# EAGLE design imuwb (EAGLE 7.6.0)
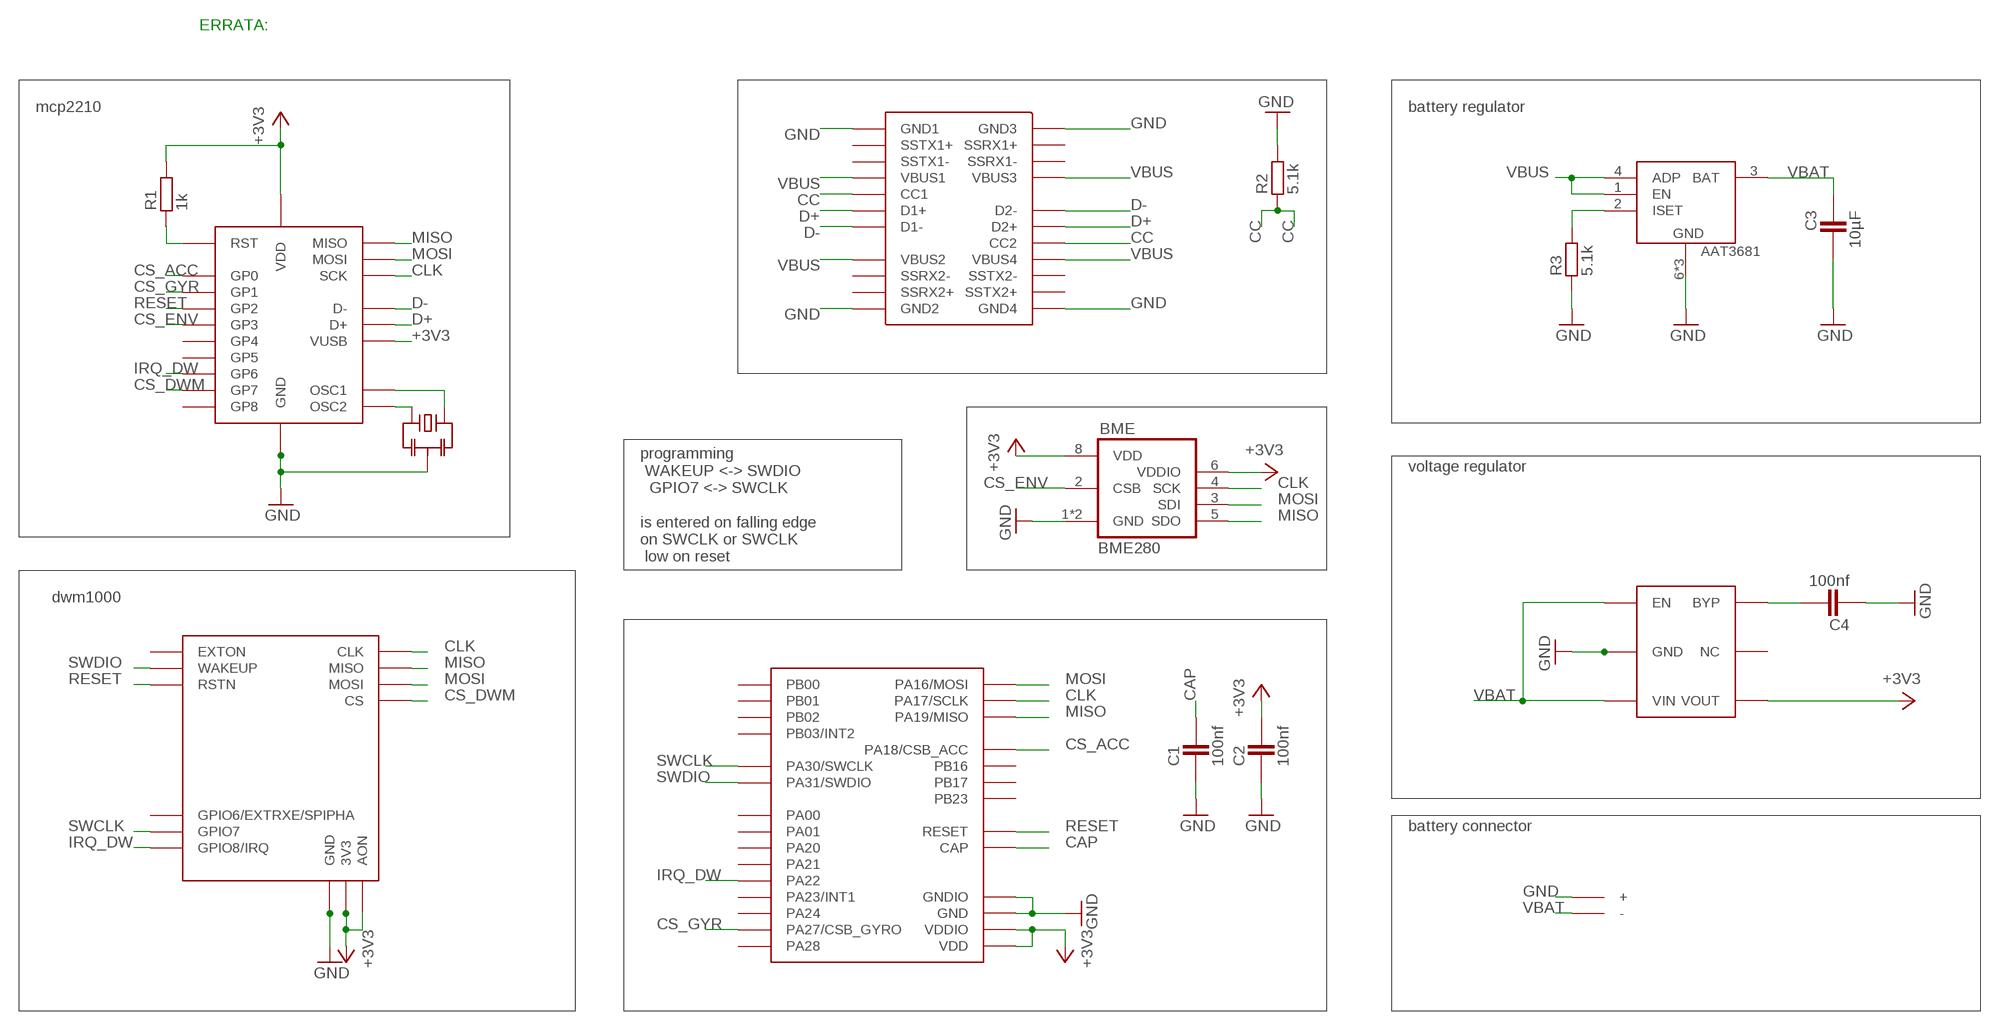
[diagram p0: schematic, sheet 1]

## Parts
AAT3681  AAT3681A  [SC70JW-8]
BME  BME280  [BME280]
BMF  BMF055  [LGA-28]
C1  100nf  CAPACITOR_0402  [CAPC1005X60N]
C2  100nf  CAPACITOR_0402  [CAPC1005X60N]
C3  10µF  CAPACITOR_0603  [CAPC1608X92N]
C4  100nf  CAPACITOR_0402  [CAPC1005X60N]
DWM  DWM1000_SPECIAL  [DWM1000_CASTELLATED_SPECIAL]
MCP2210  MCP2210  [QFN-20]
OSC  CSTCE  [CSCTE_G15C]
R1  1k  RESISTOR_0402  [RESC1005X40AN]
R2  5.1k  RESISTOR_0402  [RESC1005X40AN]
R3  5.1k  RESISTOR_0402  [RESC1005X40AN]
U$1  MIC53533.3V  [MIC5353]
U$2  BATPADS  [BATPADS]
USBC  USBC_NOSBU  [KEYSTONE_953_NOPADS_NOSBU]

## Nets
+3V3: BME.6(VDDIO) BME.8(VDD) BMF.P$3(VDD) BMF.P$28(VDDIO) C2.2 DWM.P$29(AON) DWM.P$30(3V3) DWM.P$31(3V3_1) MCP2210.P$14(VUSB) MCP2210.P$18(VDD) R1.2 U$1.P$6(VOUT)
CAP: BMF.P$9(CAP) C1.2
CC: R2.1 USBC.P$5(CC2) USBC.P$17(CC1)
CLK: BME.4(SCK) BMF.P$23(PA17/SCLK) DWM.P$44(CLK) MCP2210.P$8(SCK)
CS_ACC: BMF.P$22(PA18/CSB_ACC) MCP2210.P$2(GP0)
CS_DWM: DWM.P$41(CS) MCP2210.P$12(GP7)
CS_ENV: BME.2(CSB) MCP2210.P$5(GP3)
CS_GYR: BMF.P$12(PA27/CSB_GYRO) MCP2210.P$3(GP1)
D+: MCP2210.P$16(D+) USBC.P$6(D2+) USBC.P$18(D1+)
D-: MCP2210.P$15(D-) USBC.P$7(D2-) USBC.P$19(D1-)
GND: AAT3681.6(GND) AAT3681.7(GND) AAT3681.8(GND) BME.1(GND) BME.7(GND) BMF.P$2(GND) BMF.P$25(GNDIO) C1.1 C2.1 C3.2 C4.1 DWM.P$32(GND) DWM.P$40(GND1) DWM.P$45(GND2) DWM.P$47(GND3) DWM.P$48(GND4) MCP2210.P$17(GND) MCP2210.P$21(GND1) OSC.P$2 R2.2 R3.1 U$1.P$2(GND) U$1.P$7(GND1) U$2.P$1(+) USBC.P$1(GND4) USBC.P$12(GND3) USBC.P$13(GND1) USBC.P$24(GND2)
IRQ_DW: BMF.P$16(PA22) DWM.P$46(GPIO8/IRQ) MCP2210.P$11(GP6)
MISO: BME.5(SDO) BMF.P$21(PA19/MISO) DWM.P$43(MISO) MCP2210.P$10(MISO)
MOSI: BME.3(SDI) BMF.P$24(PA16/MOSI) DWM.P$42(MOSI) MCP2210.P$6(MOSI)
N$1: MCP2210.P$20(OSC2) OSC.P$1
N$2: MCP2210.P$19(OSC1) OSC.P$3
N$3: AAT3681.2(ISET) R3.2
N$4: C4.2 U$1.P$4(BYP)
N$5: MCP2210.P$1(RST) R1.1
RESET: BMF.P$11(RESET) DWM.P$27(RSTN) MCP2210.P$4(GP2)
SWCLK: BMF.P$8(PA30/SWCLK) DWM.P$28(GPIO7)
SWDIO: BMF.P$7(PA31/SWDIO) DWM.P$26(WAKEUP)
VBAT: AAT3681.3(BAT) C3.1 U$1.P$1(EN) U$1.P$3(VIN) U$2.P$2(-)
VBUS: AAT3681.1(EN) AAT3681.4(ADP) USBC.P$4(VBUS4) USBC.P$9(VBUS3) USBC.P$16(VBUS1) USBC.P$21(VBUS2)
Unconnected: BMF.P$1(PB03/INT2) BMF.P$4(PB02) BMF.P$5(PB01) BMF.P$6(PB00) BMF.P$10(PA28) BMF.P$13(PB23) BMF.P$14(PA24) BMF.P$15(PA23/INT1) BMF.P$17(PA21) BMF.P$18(PA20) BMF.P$19(PB17) BMF.P$20(PB16) BMF.P$26(PA01) BMF.P$27(PA00) DWM.P$25(EXTON) DWM.P$33(GPIO6/EXTRXE/SPIPHA) MCP2210.P$7(GP4) MCP2210.P$9(GP5) MCP2210.P$13(GP8) U$1.P$5(NC) USBC.P$2(SSTX2+) USBC.P$3(SSTX2-) USBC.P$10(SSRX1-) USBC.P$11(SSRX1+) USBC.P$14(SSTX1+) USBC.P$15(SSTX1-) USBC.P$22(SSRX2-) USBC.P$23(SSRX2+)

## Notes on the sheet
- ERRATA:
- mcp2210 | battery regulator
- voltage regulator
- programming
   WAKEUP <-> SWDIO
    GPIO7 <-> SWCLK
  
  is entered on falling edge 
  on SWCLK or SWCLK
   low on reset
- dwm1000
- battery connector

## Library data of the parts
AAT3681 = custom:AAT3681A: 1-cell LiIon charger; PARTNO: AAT3681AIJS-4.2-T1
BME = bosch-bme280:BME280: DIGITAL HUMIDITY, PRESSURE AND TEMPERATURE SENSOR * Digital interface I²C (up to 3.4 MHz) and SPI (3 and 4 wire, up to 10 MHz)* Supply voltage VDD main supply voltage range: 1.71 V to 3.6 V*VDDIO interface voltage range: 1.2 V to 3.6 V Operating range -40…+85 °C, 0…100 % rel. humidity, 300…1100 hPa The library has been designed by Richard Magdycz <https://www.facebook.com/groups/eaglecadsoftUK>; PARTNO: 262-BME280
BMF = custom:BMF055; PARTNO: 262-BMF055
C1-C4 = ipc-7351-capacitor:CAPACITOR_
DWM = dwm1000:DWM1000_SPECIAL; PARTNO: dwm1000
MCP2210 = custom:MCP2210; PARTNO: 579-MCP2210TIMQ
OSC = custom:CSTCE; PARTNO: PRQC12.00CR1010V00L
R1-R3 = ipc-7351-resistor:RESISTOR_
U$1 = bell-card:MIC5353; HEIGHT: .6; PARTNO: MIC5353-3.3YMT
U$2 = custom:BATPADS
USBC = custom:USBC_NOSBU

## Module TEST
Ports: 1(io) 2(io)

### Library data of the parts

## Board
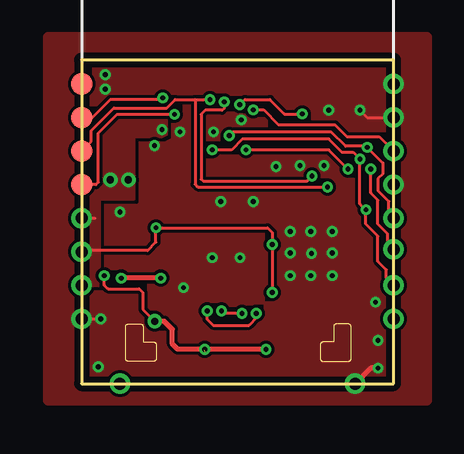
[diagram p1: board, top side]
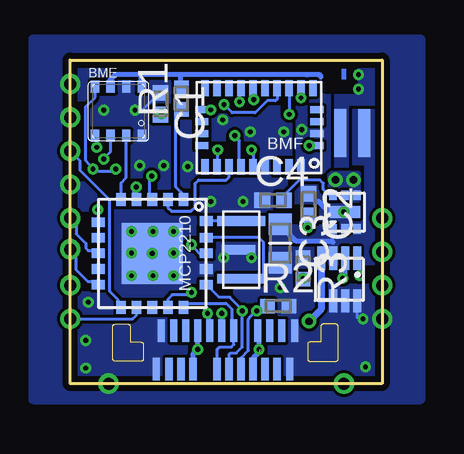
[diagram p2: board, bottom side, seen from below]

Size 13 x 13.5 mm. Coordinates in mm from the lower left corner, seen from the top.
Outline: 0,0 13,0 13,13.5 0,13.5 0,0
Copper layers (1*16): Top 0.018mm / dielectric 1.55mm / Bottom 0.018mm
Design rules "eC_2Layer_PClass7_BaseCopperO18 *": minimum track width 0.125mm, minimum drill 0.2mm, track to track 0.125mm, track to pad 0.125mm, pad to pad 0.125mm, via to via 0.125mm, smd to smd 0mil, copper to edge 0.25mm, drill to drill 0.35mm, minimum pad ring 0.175mm, minimum via ring 0.125mm, stop-mask expansion 0mil, vias tented up to drill 0.45mm, thermal gap 0.2mm

### Footprints (pad centres in the part's own frame; a part is rotated, then mirrored left to right if it is on the bottom)
SC70JW-8 = smd 0.33 x 0.97: 1 -0.75,-0.89; 2 -0.25,-0.89; 3 0.25,-0.89; 4 0.75,-0.89; 6 0.25,0.89; 7 -0.25,0.89; 8 -0.75,0.89
BME280 = smd 0.35 x 0.5: 1 0.975,-1.025; 2 0.325,-1.025; 3 -0.325,-1.025; 4 -0.975,-1.025; 5 -0.975,1.025; 6 -0.325,1.025; 7 0.325,1.025; 8 0.975,1.025
LGA-28 = smd 0 x 0: P$1 -2.25,1.643 | smd 0.55 x 0.3: P$2 -2.41,0.75; P$3 -2.41,0.25; P$4 -2.41,-0.25; P$5 -2.41,-0.75; P$16 2.39,-0.75; P$17 2.39,-0.25; P$18 2.39,0.25; P$19 2.39,0.75 | smd 0.3 x 0.65: P$6 -2.25,-1.643; P$7 -1.75,-1.643; P$8 -1.25,-1.643; P$9 -0.75,-1.643; P$10 -0.25,-1.643; P$11 0.25,-1.643; P$12 0.75,-1.643; P$13 1.25,-1.643; P$14 1.75,-1.643; P$15 2.25,-1.643; P$20 2.25,1.643; P$21 1.75,1.643; P$22 1.25,1.643; P$23 0.75,1.643; P$24 0.25,1.643; P$25 -0.25,1.643; P$26 -0.75,1.643; P$27 -1.25,1.643; P$28 -1.75,1.643
CAPC1005X60N = smd 0.65 x 0.65: 1 -0.45,0; 2 0.45,0
CAPC1608X92N = smd 0.9 x 0.95: 1 -0.8,0; 2 0.8,0
DWM1000_CASTELLATED_SPECIAL = smd 0.9 x 0.9: P$25 0,12.5; P$26 0,11.1; P$27 0,9.7; P$28 0,8.3 | drill 0.5: P$29 0,6.9; P$30 0,5.5; P$31 0,4.1; P$32 0,2.7; P$33 1.6,0; P$40 11.4,0; P$41 13,2.7; P$42 13,4.1; P$43 13,5.6; P$44 13,6.9; P$45 13,8.3; P$46 13,9.7; P$47 13,11.1; P$48 13,12.5
QFN-20 = smd 0.55 x 0.4: P$1 -2.25,1.3; P$2 -2.25,0.65; P$3 -2.25,0; P$4 -2.25,-0.65; P$5 -2.25,-1.3; P$11 2.25,-1.3; P$12 2.25,-0.65; P$13 2.25,0; P$14 2.25,0.65; P$15 2.25,1.3 | smd 0.4 x 0.55: P$6 -1.3,-2.25; P$7 -0.65,-2.25; P$8 0,-2.25; P$9 0.65,-2.25; P$10 1.3,-2.25; P$16 1.3,2.25; P$17 0.65,2.25; P$18 0,2.25; P$19 -0.65,2.25; P$20 -1.35,2.25 | smd 2.54 x 2.54: P$21 0,0
CSCTE_G15C = smd 0.4 x 2: P$1 -1.2,0; P$3 1.2,0 | smd 0.4 x 1.4: P$2 0,-0.1
RESC1005X40AN = smd 0.6 x 0.6: 1 -0.45,0; 2 0.45,0
MIC5353 = smd 0.3 x 0.4: P$1 -0.5,0.1; P$2 0,0.1; P$3 0.5,0.1; P$4 -0.5,1.5; P$5 0,1.5; P$6 0.5,1.5 | smd 1.26 x 0.5: P$7 0,0.8
BATPADS = smd 0.5 x 2: P$1 -0.5,0; P$2 0.5,0
KEYSTONE_953_NOPADS_NOSBU = smd 0.3 x 0.95: P$1 2.68,4.575; P$2 2.15,4.575; P$3 1.65,4.575; P$4 1.15,4.575; P$5 0.65,4.575; P$6 0.15,4.575; P$7 -0.35,4.575; P$9 -1.35,4.575; P$10 -1.85,4.575; P$11 -2.35,4.575; P$12 -2.88,4.575; P$13 -2.68,6.175; P$14 -2.15,6.175; P$15 -1.65,6.175; P$16 -1.15,6.175; P$17 -0.65,6.175; P$18 -0.15,6.175; P$19 0.35,6.175; P$21 1.35,6.175; P$22 1.85,6.175; P$23 2.35,6.175; P$24 2.88,6.175

### Placement (x,y rotation side)
AAT3681  1.79,4.34 180 bottom
BME  10.99,11.36 0 bottom
BMF  5.13,10.68 180 bottom
C1  9.24,11.67 270 bottom
C2  3.07,7.47 270 bottom
C3  4.25,5.85 270 bottom
C4  4.55,7.65 0 bottom
DWM  0,0 0 top
MCP2210  9.58,5.43 270 bottom
OSC  5.88,5.58 270 bottom
R1  8.37,11.88 90 bottom
R2  4.33,3.23 0 bottom
R3  3.3,4.8 270 bottom
U$1  1.55,6.35 0 bottom
U$2  1.25,10.45 0 bottom
USBC  6.53,-3.97 0 bottom

### Tracks (layer width: path | path; a pad name or v marks a point on that pad's centre or on a via)
+3V3  (via drill 0.2, 0.3)
  Top 0.125: DWM.P$30 0.05,5.55 2.75,5.55 3.1,5.9 v3.1,6.5 7.75,6.5 7.95,6.3 v7.95,5.8 v7.95,3.8 | DWM.P$29 0.55,6.9
  Bottom 0.125: DWM.P$31 0.05,4.1 | DWM.P$30 0,5.55 | v7.95,5.8 7.63,5.43 MCP2210.P$18 | v7.95,3.8 8.05,3.7 8.75,3.7 8.93,3.52 MCP2210.P$14 | R1.2 8.4,12.41 | v3.1,6.5 3.07,6.53 C2.2
  Bottom 0.2: BME.6 11.35,12.42 11.35,12.65 11.1,12.9 10.05,12.9 | BME.8 10.05,12.42 10.05,12.9 | 10.05,12.9 8.4,12.9 | 8.4,12.9 2.65,12.9 2.55,12.8 | 8.4,12.41 8.4,12.9
  other vias: 3.35,10.6 1.2,8.5 1.95,8.5
  pour Top (rank 2, no thermals): 0,4.1 0.75,4.1 0.75,7.7 2.2,7.7 2.2,10.3 3.35,10.3 3.55,10.4 3.55,11.35 3.35,11.45 0.1,11.55 0,11.45
  pour Bottom (no thermals): 3.45,12.95 2.55,12.95 2.2,12.8 2.2,9.05 2.45,8.8 3.4,8.8 3.55,8.95 3.55,12.85
  pour Bottom (rank 2, no thermals): 0.9,7.55 0.85,7.6 0.85,8.7 0.95,8.8 2.15,8.8 2.25,8.7 2.25,8.15 1.65,7.55
CAP  (via drill 0.2)
  Top 0.125: v6.59,11.64 6.8,11.85 7.85,11.85 8.45,11.25 v9.2,11.25
  Bottom 0.125: BMF.P$9 4.38,11.87 4.45,11.8 4.8,11.8 5.3,11.3 6.25,11.3 v6.59,11.64 | C1.2 9.22,11.4 v9.2,11.25
CC  (via drill 0.2)
  Top 0.125: v7.28,2.93 7.28,2.73 6.98,2.43 5.48,2.43 5.23,2.68 v5.23,3.03
  Bottom 0.125: USBC.P$17 7.18,2.93 v7.28,2.93 | USBC.P$5 5.88,1.08 5.58,1.38 5.58,2.68 5.28,3.03 v5.23,3.03 4.98,3.03 R2.1
CLK  (via drill 0.2)
  Top 0.125: DWM.P$44 12.8,7.1 12.8,7.6 12.35,8.05 12.35,8.55 12.55,8.75 12.55,9.2 v11.9,9.85 11.85,9.85 11.8,9.9 11,9.9 10.4,10.5 6.3,10.5 v6.15,10.35
  Bottom 0.125: DWM.P$44 12.75,6.65 12.75,6.25 12.35,5.85 12.35,5.65 12.25,5.55 11.95,5.55 arc90 MCP2210.P$8 | BME.4 11.9,10.27 v11.9,9.85 | v6.15,10.35 5.95,10.15 5.95,9.1 BMF.P$23
CS_ACC
  Bottom 0.125: MCP2210.P$2 8.93,7.33 8.8,7.2 7.95,7.2 7.8,7.35 7.8,8.35 7.65,8.5 6.5,8.5 6.38,8.62 BMF.P$22
CS_DWM
  Bottom 0.125: DWM.P$41 10.4,2.7 10.23,2.87 MCP2210.P$12
CS_ENV
  Bottom 0.125: MCP2210.P$5 10.88,8.37 10.66,8.59 BME.2
CS_GYR  (via drill 0.2)
  Top 0.125: v5.95,11.75 5.95,11.5 5.85,11.4 5.15,11.4 4.98,11.23 4.98,8.53 5.06,8.45 9.4,8.45 v9.6,8.65
  Bottom 0.125: BMF.P$12 5.95,12.25 v5.95,11.75 | v9.6,8.65 9.7,8.55 9.7,7.68 MCP2210.P$3
D+  (via drill 0.2)
  Top 0.125: v6.68,2.93 5.9,2.93 5.83,3 v5.83,3.03
  Bottom 0.125: USBC.P$6 6.38,1.23 6.33,1.28 6.08,1.28 5.83,1.53 v5.83,3.03 5.83,3.08 6.35,3.6 6.8,3.6 MCP2210.P$16 | USBC.P$18 v6.68,2.93
D-
  Bottom 0.125: USBC.P$7 6.88,1.43 6.78,1.53 6.28,1.53 6.18,1.63 USBC.P$19 6.25,2.27 6.25,3.1 6.5,3.35 8.15,3.35 8.28,3.22 MCP2210.P$15
GND  (via drill 0.2)  (2 unrouted)
  Top 0.125: DWM.P$32 v0.8,2.7 | v11.6,11.4 11.9,11.1 DWM.P$47
  Top 0.2: v12.35,0.65 12.05,0.65 DWM.P$40
  Bottom 0.125: BMF.P$2 v3.04,9.93 | v0.8,2.7 1.04,2.74 AAT3681.8 | C1.1 9.25,12.16 9.25,12.15 10,11.4 v10.3,11.4
  Bottom 0.2: v1.6,7.15 2.2,7.15 2.65,7.6 2.75,7.6 C2.1
  other vias: 10.45,5.45 9.58,5.43 8.7,5.45 8.7,6.35 9.55,6.35 8.7,4.5 9.55,4.5 10.45,4.5 10.45,6.35 12.35,1.8 0.7,0.7 5.5,10.5 4.1,10.5 8.1,9.05 10.1,9.1 9.1,9.1 5.45,5.25 6.6,5.25 5.8,7.6 12.25,3.4 4.25,4 0.99,12.88 0.99,12.28 6.65,11 7.15,7.6
  pour Top (rank 3, no thermals): -1.4,-0.7 14.4,-0.7 14.4,14.45 -1.4,14.45
  pour Bottom (rank 3, no thermals): -1.6,14.35 14.55,14.35 14.55,-0.65 -1.6,-0.65
IRQ_DW  (via drill 0.2)
  Top 0.125: v7.15,11.42 7.58,11.42 8.2,10.8 10.55,10.8 11.05,10.3 12.4,10.3 DWM.P$46
  Bottom 0.125: DWM.P$46 12.6,9.3 12.6,8.9 11.35,7.65 11.35,3.85 11,3.5 11,3.3 MCP2210.P$11 | BMF.P$16 v7.15,11.42
MISO  (via drill 0.2)
  Top 0.125: DWM.P$43 12.75,5.85 12.75,6.25 12.35,6.65 12.35,7.65 12.05,7.95 v12.05,8.95 | v6.85,9.75 10.3,9.75 v11.1,8.95
  Bottom 0.125: MCP2210.P$10 11.88,4.13 12.05,4.25 12.25,4.25 12.75,4.75 12.75,5.35 DWM.P$43 | BME.5 11.96,11.94 12.35,11.55 12.35,9.3 v12.05,8.95 11.95,8.85 11.2,8.85 v11.1,8.95 | v6.85,9.75 6.85,9.05 BMF.P$21
MOSI  (via drill 0.2)
  Top 0.125: DWM.P$42 12.7,4.4 12.7,4.75 12.35,5.1 12.35,6.15 11.85,6.65 v11.85,7.25 11.6,7.5 v11.6,9.36 11.31,9.65 10.85,9.65 10.3,10.2 6.7,10.2 6.25,9.75 v5.45,9.75
  Bottom 0.125: v11.85,7.25 11.83,7.23 MCP2210.P$6 | BME.3 11.31,9.69 11.6,9.4 v11.6,9.36 | v5.45,9.75 5.38,9.68 BMF.P$24
N$1
  Bottom 0.125: OSC.P$1 MCP2210.P$20
N$2
  Bottom 0.125: OSC.P$3 4.95,4.38 4.95,5.9 5.15,6.1 7.33,6.1 MCP2210.P$19
N$3  (via drill 0.2)
  Top 0.2: v3.3,4.4 v1.65,4.4
  Bottom 0.2: R3.2 3.25,4.4 | 3.15,4.5 3.25,4.4 | 3.25,4.4 v3.3,4.4 | v1.65,4.4 1.54,4.51 AAT3681.2
N$4
  Bottom 0.125: C4.2 arc90 3.9,7.85 C4.2 | U$1.P$4 2.2,7.85 2.45,8.1 2.45,8.35 2.6,8.5 3.45,8.5 4.1,7.85 C4.2
N$5
  Bottom 0.125: MCP2210.P$1 8.37,7.68 8.37,7.97 8.6,8.2 8.6,11.25 R1.1
RESET  (via drill 0.2)
  Top 0.125: DWM.P$27 0.4,10.1 0.4,10.55 1.35,11.5 3.55,11.5 3.9,11.85 4.73,11.85 | 4.73,11.85 v5.35,11.85 | 4.73,11.85 4.73,8.32 4.85,8.2 v10.25,8.2
  Bottom 0.125: BMF.P$11 5.38,11.88 v5.35,11.85 | MCP2210.P$4 10.35,7.68 10.35,8.1 v10.25,8.2
SWCLK  (via drill 0.2)
  Top 0.125: DWM.P$28 0.6,8.3 0.7,8.4 0.7,10.45 1.48,11.23 v3.87,11.23 3.48,11.23
  Bottom 0.125: BMF.P$8 v3.87,11.23
SWDIO  (via drill 0.2)
  Top 0.125: v3.38,11.92 3.31,11.85 1.2,11.85 0.45,11.1 DWM.P$26
  Bottom 0.125: BMF.P$7 v3.38,11.92
VBAT
  Bottom 0.2: C3.1 3.9,6.3 3.9,6.25 3.6,5.95 2.1,5.95 2.05,5.9
  pour Bottom (no thermals): 0,5 0,11.4 1.2,11.4 1.2,9.15 0.7,9.15 0.7,7.45 1.15,7.45 1.15,6.15 1.95,6.15 1.95,6.6 4.65,6.6 4.65,5.9 2.2,5.9 2.2,5
VBUS  (via drill 0.2, 0.3)  (1 unrouted)
  Top 0.125: v3.05,2.6 2.55,3.1 2.55,3.8 2.4,3.95 1.1,3.95 0.95,4.1 v0.95,4.5
  Top 0.2: v7.68,1.43 7.61,1.45 5.15,1.45 v5.13,1.43 4,1.43 3.78,1.65 3.78,2.27 3.45,2.6 v3.05,2.6
  Top 0.3: 5.1,1.4 v5.13,1.43
  Bottom 0.125: AAT3681.1 0.95,5.23 v0.95,4.5
  Bottom 0.2: USBC.P$9 7.88,1.23 v7.68,1.43 USBC.P$16 | v5.13,1.43 5.13,2.15 USBC.P$21 | 5.35,0.9 5.38,0.87 USBC.P$4 5.38,1.07 5.13,1.32
  Bottom 0.3: AAT3681.4 2.55,3.1 v3.05,2.6

### Text on the board
Bottom: -